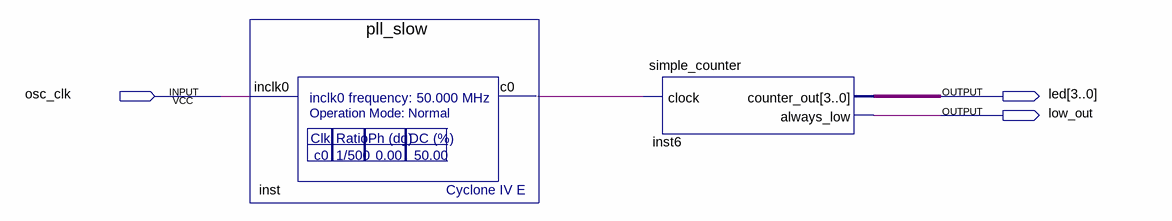
[diagram p0: schematic sheet]
// Quartus schematic HelloWorld.bdf as structural Verilog: 2 symbols, 3 pins
module HelloWorld (
  input  osc_clk,
  output [3:0] led,
  output low_out
);

  wire inst_c0;

  pll_slow inst (.inclk0(osc_clk), .c0(inst_c0));
  simple_counter inst6 (.clock(inst_c0), .counter_out(led), .always_low(low_out));
endmodule
